# Altium project 19主控.PrjPCB
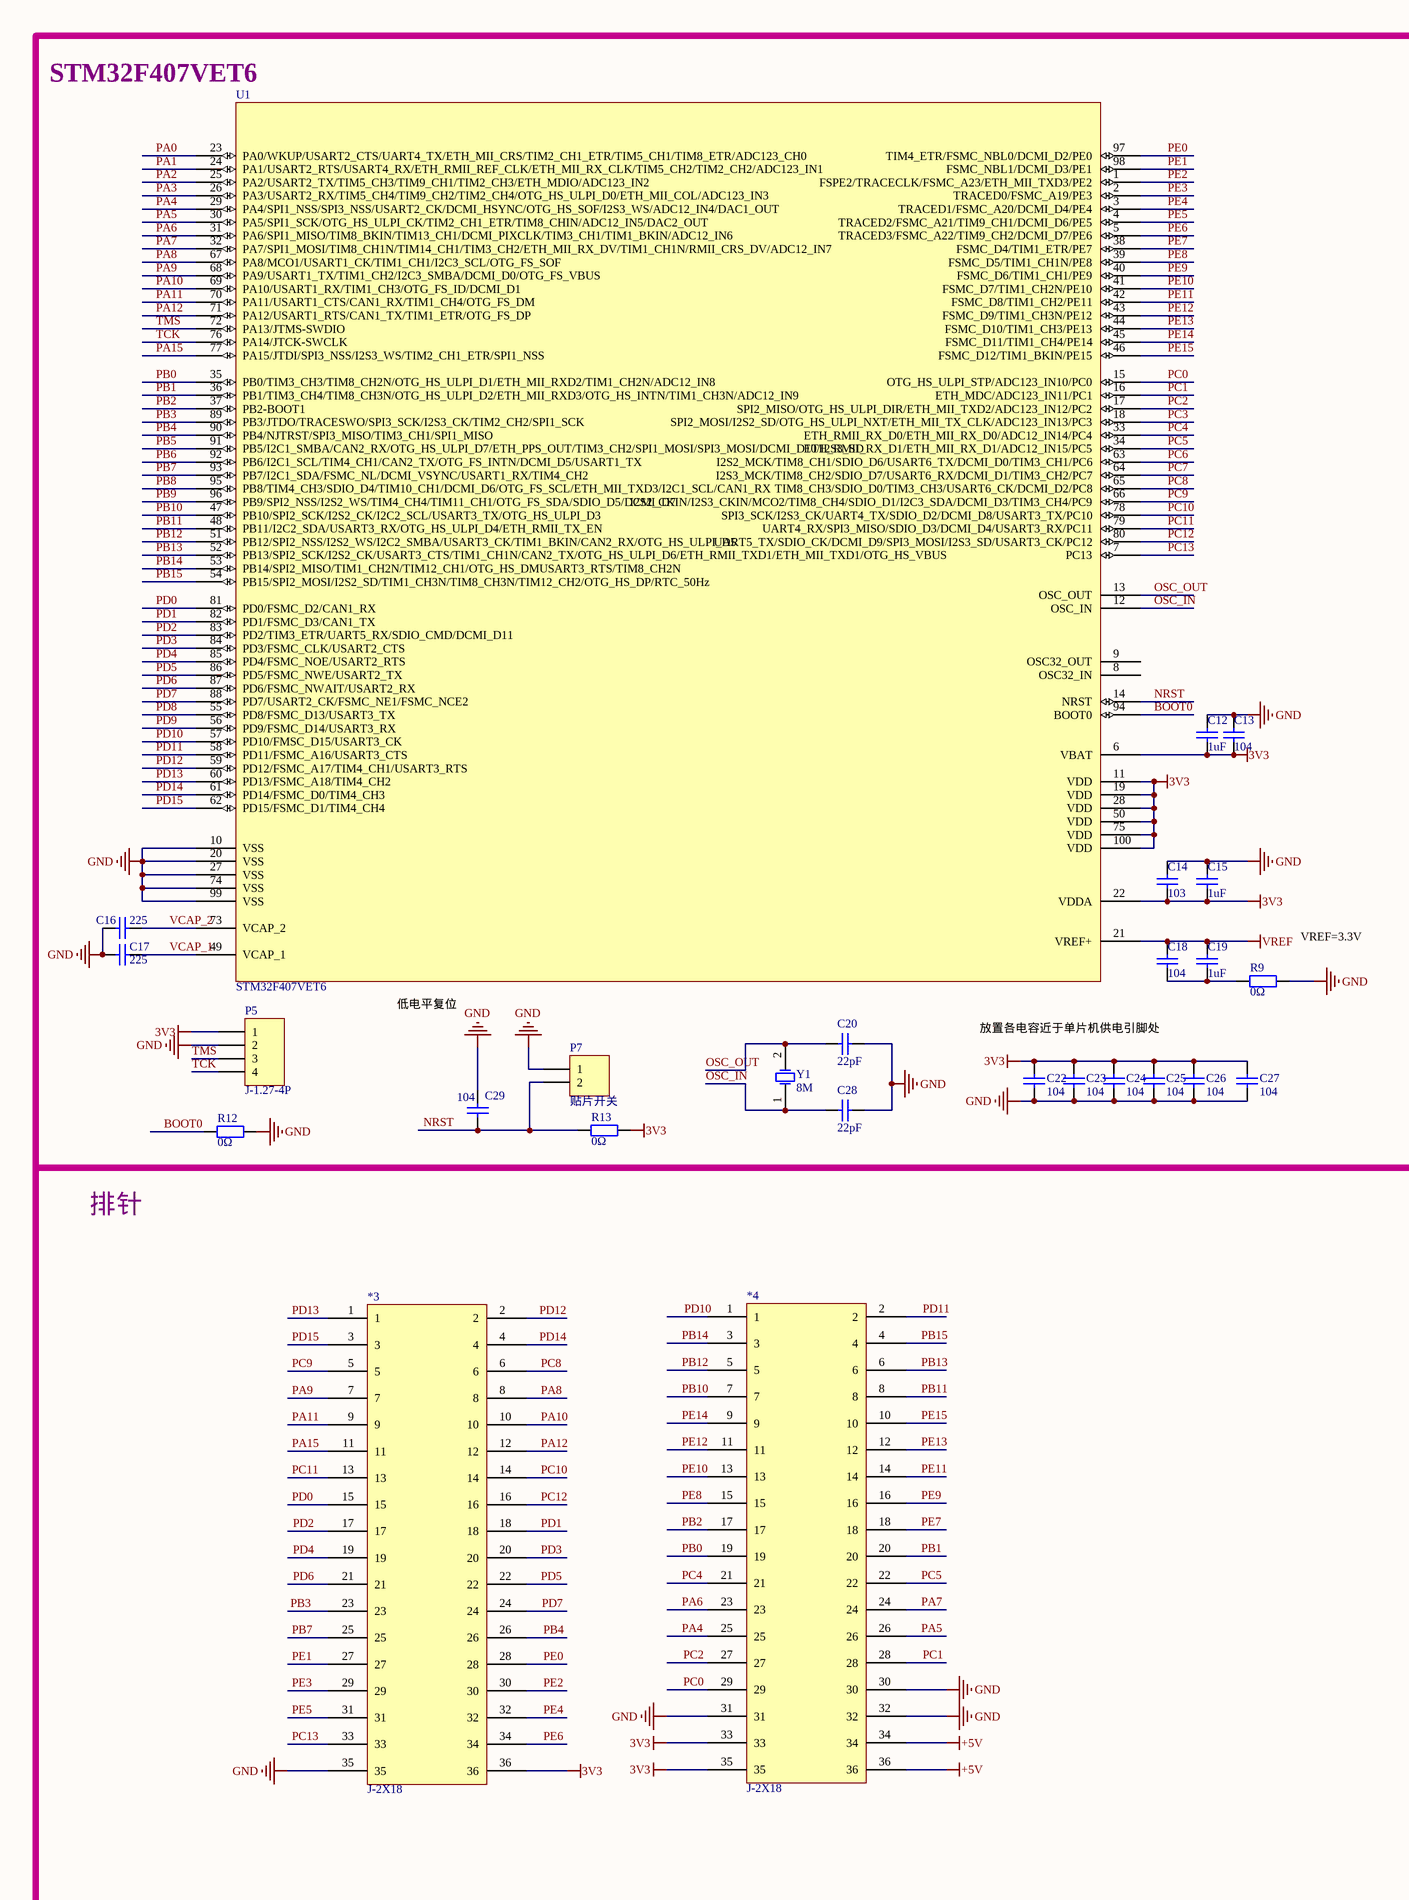
[diagram p0: 19主控.SchDoc, left]
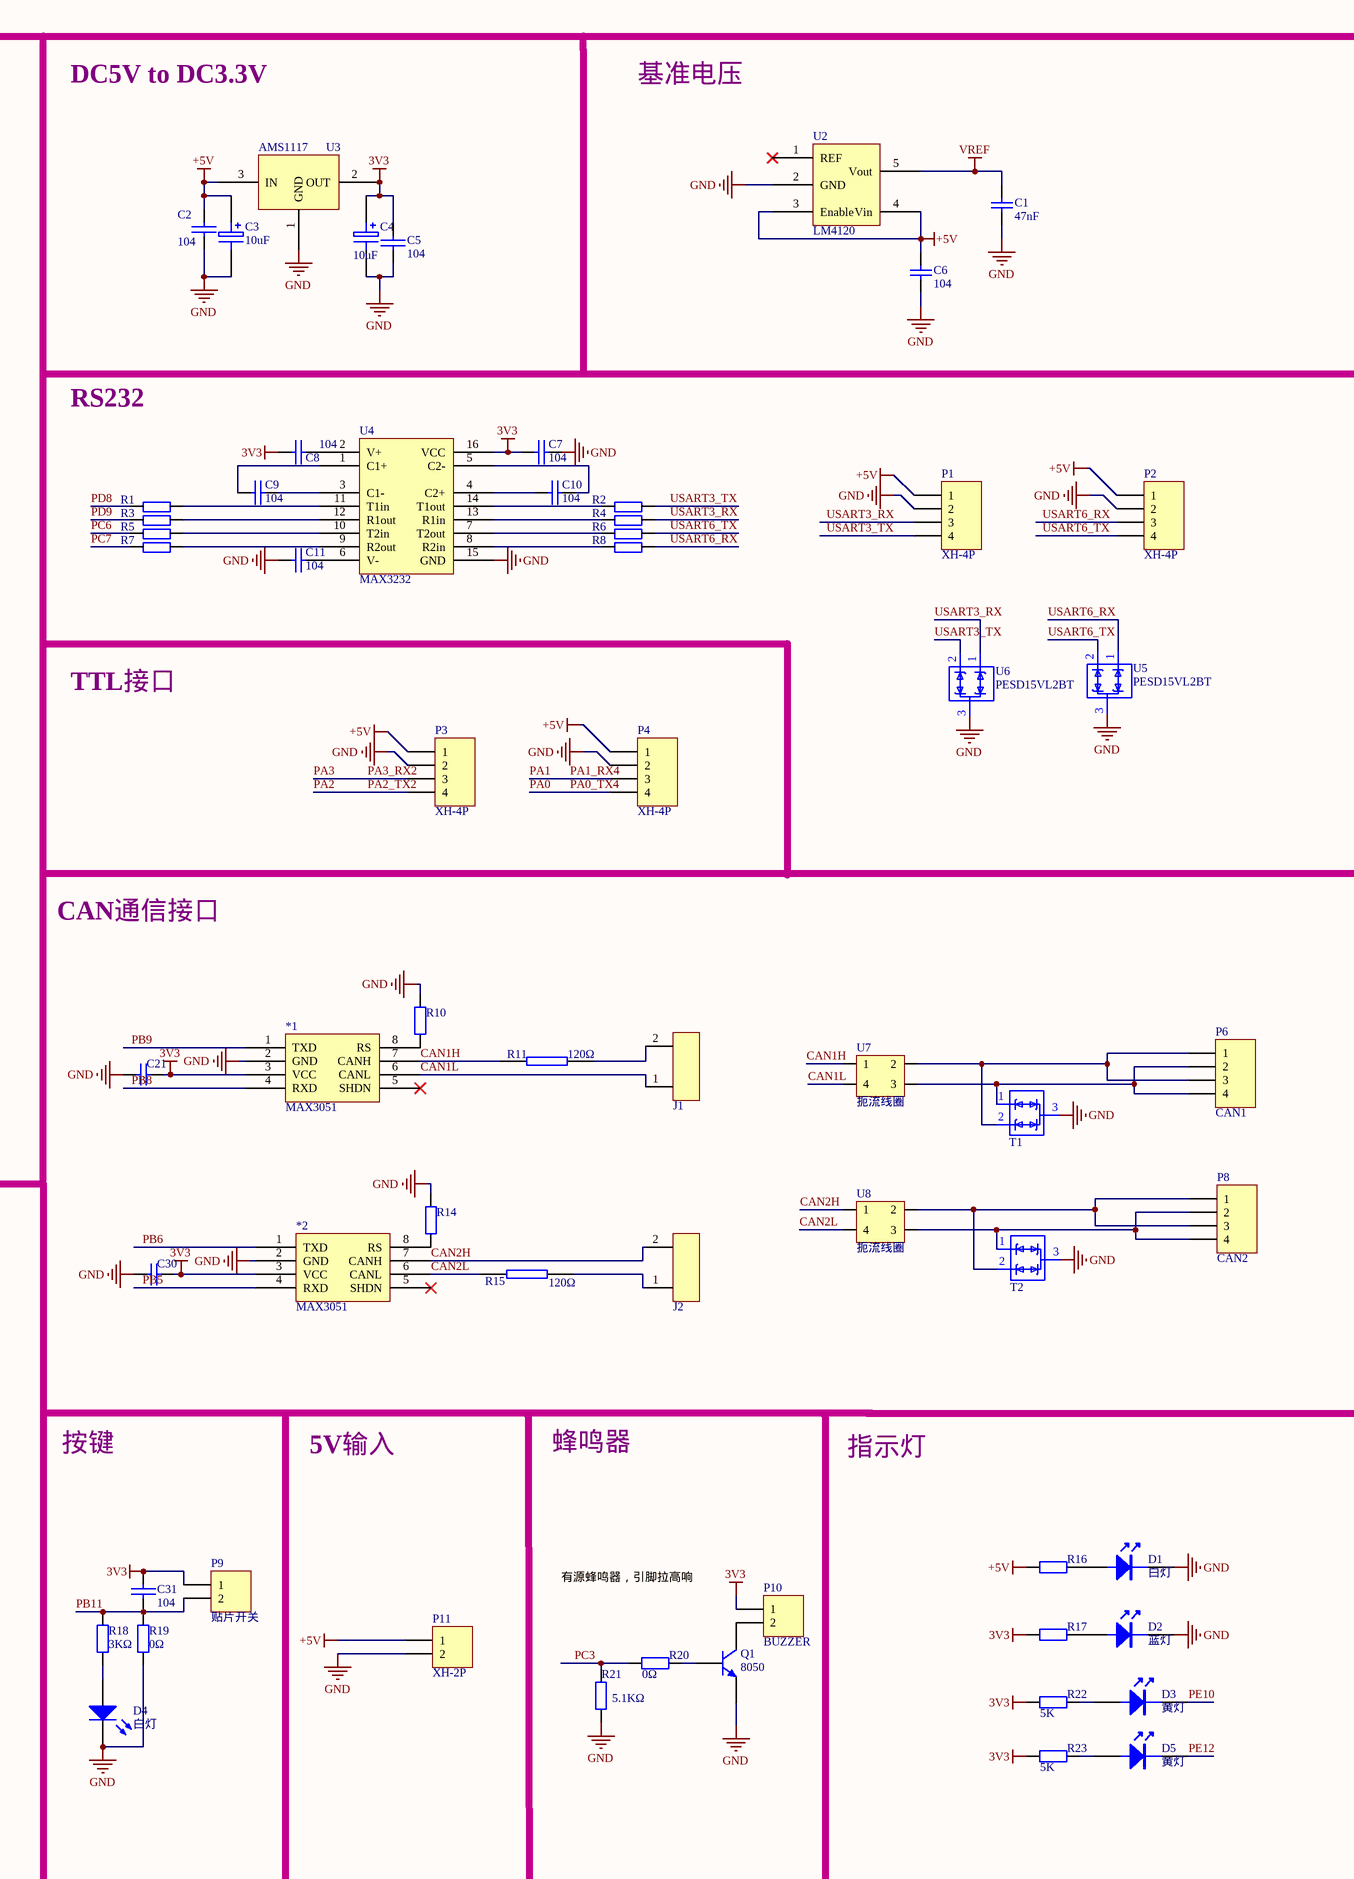
[diagram p1: 19主控.SchDoc, right]
1 sheet, 88 parts. Net scope: global (net labels, ports and power ports of the same name join across sheets).
Board file: 19主控.PcbDoc

## Sheet 19主控.SchDoc
size A2

### Parts
*1  MAX3051  [SOT-23-8]
*2  MAX3051  [SOT-23-8]
*3  J-2X18  [HDR2X18 排座]
*4  J-2X18  [HDR2X18 排座]
C1  47nF  [0603_C]
C2  104  [0603_C]
C3  10uF  [0603_C]
C4  10uF  [0603_C]
C5  104  [0603_C]
C6  104  [0603_C]
C7  104  [0603_C]
C8  104  [0603_C]
C9  104  [0603_C]
C10  104  [0603_C]
C11  104  [0603_C]
C12  1uF  [0603_C]
C13  104  [0603_C]
C14  103  [0603_C]
C15  1uF  [0603_C]
C16  225  [0603_C]
C17  225  [0603_C]
C18  104  [0603_C]
C19  1uF  [0603_C]
C20  22pF  [0603_C]
C21  104  [0603_C]  (value not drawn)
C22  104  [0603_C]
C23  104  [0603_C]
C24  104  [0603_C]
C25  104  [0603_C]
C26  104  [0603_C]
C27  104  [0603_C]
C28  22pF  [0603_C]
C29  104  [0603_C]
C30  104  [0603_C]  (value not drawn)
C31  104  [0603_C]
D1  白灯  [0603_LED_S1]
D2  蓝灯  [0603_LED_S1]
D3  黄灯  [0603_LED_S1]
D4  白灯  [0603_LED_S1]
D5  黄灯  [0603_LED_S1]
J1  拨码开关  [拨码开关贴片1位]  (value not drawn)
J2  拨码开关  [拨码开关贴片1位]  (value not drawn)
P1  XH-4P  [J-xh-4AW短]
P2  XH-4P  [J-xh-4AW短]
P3  XH-4P  [J-xh-4AW短]
P4  XH-4P  [J-xh-4AW短]
P5  J-1.27-4P  [J-1.27-4P]
P6  CAN1  [J-Molex小5557-2*2]
P7  贴片开关  [按键2脚]
P8  CAN2  [J-Molex小5557-2*2]
P9  贴片开关  [按键2脚]
P10  BUZZER  [直插蜂鸣器-9.6mm]
P11  XH-2P  [J-XH-2AW短]
Q1  8050  [SOT-233]
R1  120Ω  [0603_R]  (value not drawn)
R2  120Ω  [0603_R]  (value not drawn)
R3  120Ω  [0603_R]  (value not drawn)
R4  120Ω  [0603_R]  (value not drawn)
R5  120Ω  [0603_R]  (value not drawn)
R6  120Ω  [0603_R]  (value not drawn)
R7  120Ω  [0603_R]  (value not drawn)
R8  120Ω  [0603_R]  (value not drawn)
R9  0Ω  [R-0603]
R10  0Ω  [0603_R]  (value not drawn)
R11  120Ω  [0603_R]
R12  0Ω  [0603_R]
R13  0Ω  [0603_R]
R14  0Ω  [0603_R]  (value not drawn)
R15  120Ω  [0603_R]
R16  5.1KΩ  [0603_R]  (value not drawn)
R17  0Ω  [0603_R]  (value not drawn)
R18  3KΩ  [0603_R]
R19  0Ω  [0603_R]
R20  0Ω  [0603_R]
R21  5.1KΩ  [0603_R]
R22  5K  [0603_R]
R23  5K  [0603_R]
T1  双向TVS管  [SOT-233]  (value not drawn)
T2  双向TVS管  [SOT-233]  (value not drawn)
U1  STM32F407VET6  [LQFP-100_14x14x05P]
U2  LM4120  [SOT-235]
U3  AMS1117  [sot-223]
U4  MAX3232  [SSOP-16]
U5  PESD15VL2BT  [SOT-233]
U6  PESD15VL2BT  [SOT-233]
U7  扼流线圈  [共模电感ACT45B-2P]
U8  扼流线圈  [共模电感ACT45B-2P]
Y1  8M  [X-HC49S]

### Nets
3V3: *1.3(VCC) *2.3(VCC) *3.36 *4.33 *4.35 C4.1 C5.1 C7.1 C8.1 C12.1 C13.1 C14.1 C15.1 C21.2 C22.2 C23.2 C24.2 C25.2 C26.2 C27.2 C30.2 C31.1 P5.1 P9.1 P10.1 R13.2 R17.1 R22.1 R23.1 U1.6(VBAT) U1.11(VDD) U1.19(VDD) U1.22(VDDA) U1.28(VDD) U1.50(VDD) U1.75(VDD) U1.100(VDD) U3.2(OUT) U4.16(VCC)
+5V: *4.34 *4.36 C2.1 C3.1 C6.2 P1.1 P2.1 P3.1 P4.1 P11.1 R16.1 U2.3(Enable) U2.4(Vin) U3.3(IN)
GND: *1.2(GND) *2.2(GND) *3.35 *4.30 *4.31 *4.32 C1.1 C2.2 C3.2 C4.2 C5.2 C6.1 C7.2 C11.2 C12.2 C13.2 C14.2 C15.2 C16.1 C17.1 C20.2 C21.1 C22.1 C23.1 C24.1 C25.1 C26.1 C27.1 C28.2 C29.2 C30.1 D1.K D2.K D4.K P1.2 P2.2 P3.2 P4.2 P5.2 P7.1 P11.2 Q1.2(E) R9.1 R10.2 R12.2 R14.2 R19.1 R21.1 T1.3 T2.3 U1.10(VSS) U1.20(VSS) U1.27(VSS) U1.74(VSS) U1.99(VSS) U2.2(GND) U3.1(GND) U4.15(GND) U5.3 U6.3
VREF: C1.2 C18.2 C19.2 U1.21(VREF+) U2.5(Vout)
BOOT0: R12.1 U1.94(BOOT0)
CAN1H: *1.7(CANH) R11.2 U7.1
CAN1L: *1.6(CANL) J1.1 U7.4
CAN2H: *2.7(CANH) J2.2 U8.1
CAN2L: *2.6(CANL) R15.2 U8.4
NRST: C29.1 P7.2 R13.1 U1.14(NRST)
OSC_IN: C28.1 U1.12(OSC_IN) Y1.1(OSC1)
OSC_OUT: C20.1 U1.13(OSC_OUT) Y1.2(OSC2)
PA0: P4.4 U1.23(PA0/WKUP/USART2_CTS/UART4_TX/ETH_MII_CRS/TIM2_CH1_ETR/TIM5_CH1/TIM8_ETR/ADC123_CH0)  [also labelled PA0_TX4]
PA1: P4.3 U1.24(PA1/USART2_RTS/USART4_RX/ETH_RMII_REF_CLK/ETH_MII_RX_CLK/TIM5_CH2/TIM2_CH2/ADC123_IN1)  [also labelled PA1_RX4]
PA2: P3.4 U1.25(PA2/USART2_TX/TIM5_CH3/TIM9_CH1/TIM2_CH3/ETH_MDIO/ADC123_IN2)  [also labelled PA2_TX2]
PA3: P3.3 U1.26(PA3/USART2_RX/TIM5_CH4/TIM9_CH2/TIM2_CH4/OTG_HS_ULPI_D0/ETH_MII_COL/ADC123_IN3)  [also labelled PA3_RX2]
PA4: *4.25 U1.29(PA4/SPI1_NSS/SPI3_NSS/USART2_CK/DCMI_HSYNC/OTG_HS_SOF/I2S3_WS/ADC12_IN4/DAC1_OUT)
PA5: *4.26 U1.30(PA5/SPI1_SCK/OTG_HS_ULPI_CK/TIM2_CH1_ETR/TIM8_CHIN/ADC12_IN5/DAC2_OUT)
PA6: *4.23 U1.31(PA6/SPI1_MISO/TIM8_BKIN/TIM13_CH1/DCMI_PIXCLK/TIM3_CH1/TIM1_BKIN/ADC12_IN6)
PA7: *4.24 U1.32(PA7/SPI1_MOSI/TIM8_CH1N/TIM14_CH1/TIM3_CH2/ETH_MII_RX_DV/TIM1_CH1N/RMII_CRS_DV/ADC12_IN7)
PA8: *3.8 U1.67(PA8/MCO1/USART1_CK/TIM1_CH1/I2C3_SCL/OTG_FS_SOF)
PA9: *3.7 U1.68(PA9/USART1_TX/TIM1_CH2/I2C3_SMBA/DCMI_D0/OTG_FS_VBUS)
PA10: *3.10 U1.69(PA10/USART1_RX/TIM1_CH3/OTG_FS_ID/DCMI_D1)
PA11: *3.9 U1.70(PA11/USART1_CTS/CAN1_RX/TIM1_CH4/OTG_FS_DM)
PA12: *3.12 U1.71(PA12/USART1_RTS/CAN1_TX/TIM1_ETR/OTG_FS_DP)
PA15: *3.11 U1.77(PA15/JTDI/SPI3_NSS/I2S3_WS/TIM2_CH1_ETR/SPI1_NSS)
PB0: *4.19 U1.35(PB0/TIM3_CH3/TIM8_CH2N/OTG_HS_ULPI_D1/ETH_MII_RXD2/TIM1_CH2N/ADC12_IN8)
PB1: *4.20 U1.36(PB1/TIM3_CH4/TIM8_CH3N/OTG_HS_ULPI_D2/ETH_MII_RXD3/OTG_HS_INTN/TIM1_CH3N/ADC12_IN9)
PB2: *4.17 U1.37(PB2-BOOT1)
PB3: *3.23 U1.89(PB3/JTDO/TRACESWO/SPI3_SCK/I2S3_CK/TIM2_CH2/SPI1_SCK)
PB4: *3.26 U1.90(PB4/NJTRST/SPI3_MISO/TIM3_CH1/SPI1_MISO)
PB5: *2.4(RXD) U1.91(PB5/I2C1_SMBA/CAN2_RX/OTG_HS_ULPI_D7/ETH_PPS_OUT/TIM3_CH2/SPI1_MOSI/SPI3_MOSI/DCMI_D10/I2S3_SD)
PB6: *2.1(TXD) U1.92(PB6/I2C1_SCL/TIM4_CH1/CAN2_TX/OTG_FS_INTN/DCMI_D5/USART1_TX)
PB7: *3.25 U1.93(PB7/I2C1_SDA/FSMC_NL/DCMI_VSYNC/USART1_RX/TIM4_CH2)
PB8: *1.4(RXD) U1.95(PB8/TIM4_CH3/SDIO_D4/TIM10_CH1/DCMI_D6/OTG_FS_SCL/ETH_MII_TXD3/I2C1_SCL/CAN1_RX)
PB9: *1.1(TXD) U1.96(PB9/SPI2_NSS/I2S2_WS/TIM4_CH4/TIM11_CH1/OTG_FS_SDA/SDIO_D5/DCMI_D7)
PB10: *4.7 U1.47(PB10/SPI2_SCK/I2S2_CK/I2C2_SCL/USART3_TX/OTG_HS_ULPI_D3)
PB11: *4.8 C31.2 P9.2 R18.2 R19.2 U1.48(PB11/I2C2_SDA/USART3_RX/OTG_HS_ULPI_D4/ETH_RMII_TX_EN)
PB12: *4.5 U1.51(PB12/SPI2_NSS/I2S2_WS/I2C2_SMBA/USART3_CK/TIM1_BKIN/CAN2_RX/OTG_HS_ULPI_D5)
PB13: *4.6 U1.52(PB13/SPI2_SCK/I2S2_CK/USART3_CTS/TIM1_CH1N/CAN2_TX/OTG_HS_ULPI_D6/ETH_RMII_TXD1/ETH_MII_TXD1/OTG_HS_VBUS)
PB14: *4.3 U1.53(PB14/SPI2_MISO/TIM1_CH2N/TIM12_CH1/OTG_HS_DMUSART3_RTS/TIM8_CH2N)
PB15: *4.4 U1.54(PB15/SPI2_MOSI/I2S2_SD/TIM1_CH3N/TIM8_CH3N/TIM12_CH2/OTG_HS_DP/RTC_50Hz)
PC0: *4.29 U1.15(OTG_HS_ULPI_STP/ADC123_IN10/PC0)
PC1: *4.28 U1.16(ETH_MDC/ADC123_IN11/PC1)
PC2: *4.27 U1.17(SPI2_MISO/OTG_HS_ULPI_DIR/ETH_MII_TXD2/ADC123_IN12/PC2)
PC3: R20.1 R21.2 U1.18(SPI2_MOSI/I2S2_SD/OTG_HS_ULPI_NXT/ETH_MII_TX_CLK/ADC123_IN13/PC3)
PC4: *4.21 U1.33(ETH_RMII_RX_D0/ETH_MII_RX_D0/ADC12_IN14/PC4)
PC5: *4.22 U1.34(ETH_RMII_RX_D1/ETH_MII_RX_D1/ADC12_IN15/PC5)
PC6: R5.1 U1.63(I2S2_MCK/TIM8_CH1/SDIO_D6/USART6_TX/DCMI_D0/TIM3_CH1/PC6)
PC7: R7.1 U1.64(I2S3_MCK/TIM8_CH2/SDIO_D7/USART6_RX/DCMI_D1/TIM3_CH2/PC7)
PC8: *3.6 U1.65(TIM8_CH3/SDIO_D0/TIM3_CH3/USART6_CK/DCMI_D2/PC8)
PC9: *3.5 U1.66(I2S2_CKIN/I2S3_CKIN/MCO2/TIM8_CH4/SDIO_D1/I2C3_SDA/DCMI_D3/TIM3_CH4/PC9)
PC10: *3.14 U1.78(SPI3_SCK/I2S3_CK/UART4_TX/SDIO_D2/DCMI_D8/USART3_TX/PC10)
PC11: *3.13 U1.79(UART4_RX/SPI3_MISO/SDIO_D3/DCMI_D4/USART3_RX/PC11)
PC12: *3.16 U1.80(UART5_TX/SDIO_CK/DCMI_D9/SPI3_MOSI/I2S3_SD/USART3_CK/PC12)
PC13: *3.33 U1.7(PC13)
PD0: *3.15 U1.81(PD0/FSMC_D2/CAN1_RX)
PD1: *3.18 U1.82(PD1/FSMC_D3/CAN1_TX)
PD2: *3.17 U1.83(PD2/TIM3_ETR/UART5_RX/SDIO_CMD/DCMI_D11)
PD3: *3.20 U1.84(PD3/FSMC_CLK/USART2_CTS)
PD4: *3.19 U1.85(PD4/FSMC_NOE/USART2_RTS)
PD5: *3.22 U1.86(PD5/FSMC_NWE/USART2_TX)
PD6: *3.21 U1.87(PD6/FSMC_NWAIT/USART2_RX)
PD7: *3.24 U1.88(PD7/USART2_CK/FSMC_NE1/FSMC_NCE2)
PD8: R1.1 U1.55(PD8/FSMC_D13/USART3_TX)
PD9: R3.1 U1.56(PD9/FSMC_D14/USART3_RX)
PD10: *4.1 U1.57(PD10/FMSC_D15/USART3_CK)
PD11: *4.2 U1.58(PD11/FSMC_A16/USART3_CTS)
PD12: *3.2 U1.59(PD12/FSMC_A17/TIM4_CH1/USART3_RTS)
PD13: *3.1 U1.60(PD13/FSMC_A18/TIM4_CH2)
PD14: *3.4 U1.61(PD14/FSMC_D0/TIM4_CH3)
PD15: *3.3 U1.62(PD15/FSMC_D1/TIM4_CH4)
PE0: *3.28 U1.97(TIM4_ETR/FSMC_NBL0/DCMI_D2/PE0)
PE1: *3.27 U1.98(FSMC_NBL1/DCMI_D3/PE1)
PE2: *3.30 U1.1(FSPE2/TRACECLK/FSMC_A23/ETH_MII_TXD3/PE2)
PE3: *3.29 U1.2(TRACED0/FSMC_A19/PE3)
PE4: *3.32 U1.3(TRACED1/FSMC_A20/DCMI_D4/PE4)
PE5: *3.31 U1.4(TRACED2/FSMC_A21/TIM9_CH1/DCMI_D6/PE5)
PE6: *3.34 U1.5(TRACED3/FSMC_A22/TIM9_CH2/DCMI_D7/PE6)
PE7: *4.18 U1.38(FSMC_D4/TIM1_ETR/PE7)
PE8: *4.15 U1.39(FSMC_D5/TIM1_CH1N/PE8)
PE9: *4.16 U1.40(FSMC_D6/TIM1_CH1/PE9)
PE10: *4.13 D3.K U1.41(FSMC_D7/TIM1_CH2N/PE10)
PE11: *4.14 U1.42(FSMC_D8/TIM1_CH2/PE11)
PE12: *4.11 D5.K U1.43(FSMC_D9/TIM1_CH3N/PE12)
PE13: *4.12 U1.44(FSMC_D10/TIM1_CH3/PE13)
PE14: *4.9 U1.45(FSMC_D11/TIM1_CH4/PE14)
PE15: *4.10 U1.46(FSMC_D12/TIM1_BKIN/PE15)
TCK: P5.4 U1.76(PA14/JTCK-SWCLK)
TMS: P5.3 U1.72(PA13/JTMS-SWDIO)
USART3_RX: P1.3 R4.2 U6.1
USART3_TX: P1.4 R2.2 U6.2
USART6_RX: P2.3 R8.2 U5.1
USART6_TX: P2.4 R6.2 U5.2
VCAP_1: C17.2 U1.49(VCAP_1)
VCAP_2: C16.2 U1.73(VCAP_2)
Net*1_8: *1.8(RS) R10.1
Net*2_8: *2.8(RS) R14.1
NetC8_2: C8.2 U4.2(V+)
NetC9_1: C9.1 U4.1(C1+)
NetC9_2: C9.2 U4.3(C1-)
NetC10_1: C10.1 U4.4(C2+)
NetC10_2: C10.2 U4.5(C2-)
NetC11_1: C11.1 U4.6(V-)
NetC18_1: C18.1 C19.1 R9.2
NetD1_A: D1.A R16.2
NetD2_A: D2.A R17.2
NetD3_A: D3.A R22.2
NetD4_A: D4.A R18.1
NetD5_A: D5.A R23.2
NetJ1_2: J1.2 R11.1
NetJ2_1: J2.1 R15.1
NetP6_1: P6.1 P6.3 T1.2 U7.2
NetP6_2: P6.2 P6.4 T1.1 U7.3
NetP8_1: P8.1 P8.3 T2.2 U8.2
NetP8_2: P8.2 P8.4 T2.1 U8.3
NetP10_2: P10.2 Q1.3(C)
NetQ1_1: Q1.1(B) R20.2
NetR1_2: R1.2 U4.11(T1in)
NetR2_1: R2.1 U4.14(T1out)
NetR3_2: R3.2 U4.12(R1out)
NetR4_1: R4.1 U4.13(R1in)
NetR5_2: R5.2 U4.10(T2in)
NetR6_1: R6.1 U4.7(T2out)
NetR7_2: R7.2 U4.9(R2out)
NetR8_1: R8.1 U4.8(R2in)

Not connected (* = marked no-connect by the designer): *1 5(SHDN)*; *2 5(SHDN)*; U1 8(OSC32_IN) 9(OSC32_OUT); U2 1(REF)*

### Notes on the sheet
- STM32F407VET6
- DC5V to DC3.3V
- 基准电压
- RS232
- TTL接口
- (near R9) VREF=3.3V
- CAN通信接口
- (near U1) 低电平复位
- 放置各电容近于单片机供电引脚处
- 排针
- 按键
- 5V输入
- 蜂鸣器
- 指示灯
- 有源蜂鸣器，引脚拉高响
- Title
- Size:
- Date:
- File:
- A2
- Number:
- Time:
- Revision:
- Sheet
- of

### Library data of the parts
*1 *2 = MAX3051EKA+T
C1 C6 C12-C20 C22-C29 = Cap: Capacitor; Published: 8-Jun-2000; LatestRevisionDate: 17-Jul-2002; LatestRevisionNote: Re-released for DXP Platform.; PackageReference: RAD-0.3; Publisher: Altium Limited
C2 C5 C7-C11 C31 = CAP: Capacitor
C3 C4 = ELECTRO1: Electrolytic Capacitor
C21 C30 = 0603 100nF (104) 10% 50V: 贴片电容; ComponentLink1Description: 供应商链接; ComponentLink1URL: http://www.szlcsc.com/product/details_15331.html; Package: 0603; Supplier: LC; SuppliersPartNumber: C14663
D1-D3 D5 = LED
D4 = LED0: Typical INFRARED GaAs LED; Published: 8-Jun-2000; LatestRevisionDate: 08-Jul-2005; LatestRevisionNote: Mech Layer 1 removed.; PackageReference: LED-0; Publisher: Altium Limited
J1 J2 = J-2PIN: SOCKET
P1-P6 P8 = Header 4: Header, 4-Pin; LatestRevisionDate: 17-Jul-2002; LatestRevisionNote: Re-released for DXP Platform.; Publisher: Altium Limited
P7 P9-P11 = Header 2: Header, 2-Pin; LatestRevisionDate: 17-Jul-2002; LatestRevisionNote: Re-released for DXP Platform.; Publisher: Altium Limited
Q1 = 2N3904: NPN General Purpose Amplifier; Published: 8-Jun-2000; LatestRevisionDate: 15-Jan-2003; LatestRevisionNote: PCB Footprint 'BCY-W3/D4.7' replaced; DatasheetDocument: 1997; PackageDocument: Sep-1998; PackageReference: TO-92A; Publisher: Altium Limited; Code_JEDEC: TO-92A; ComponentLink1Description: Manufacturer Link; ComponentLink1URL: http://www.fairchildsemi.com/; ComponentLink2Description: Datasheet; ComponentLink2URL: http://www.fairchildsemi.com/ds/2N%2F2N3904.pdf
R1-R8 = R-贴片电阻 -0603: 贴片电阻; Package: 0603
R9 R12 R13 R16-R23 = Res2: Resistor
  R9 R12 R13 R16 R17 R19-R23: Published: 8-Jun-2000; LatestRevisionDate: 17-Jul-2002; LatestRevisionNote: Re-released for DXP Platform.; PackageReference: AXIAL-0.4; Publisher: Altium Limited
R10 R14 = 0603 120Ω (1200) 1%: 贴片电阻; ComponentLink1Description: 供应商链接; ComponentLink1URL: http://www.szlcsc.com/product/details_23514.html; Package: 0603; Supplier: LC; SuppliersPartNumber: C22787
R11 R15 = RES2
U3 = Component_1
U5 U6 = PESD2CAN
U7 U8 = 扼流线圈: B82793C0/S0
Y1 = XTAL: Crystal Oscillator; Published: 8-Jun-2000; LatestRevisionDate: 17-Jul-2002; LatestRevisionNote: Re-released for DXP Platform.; PackageReference: R38; Publisher: Altium Limited